# EAGLE design SCA3100-D04 Breakout (EAGLE 8.5.1)
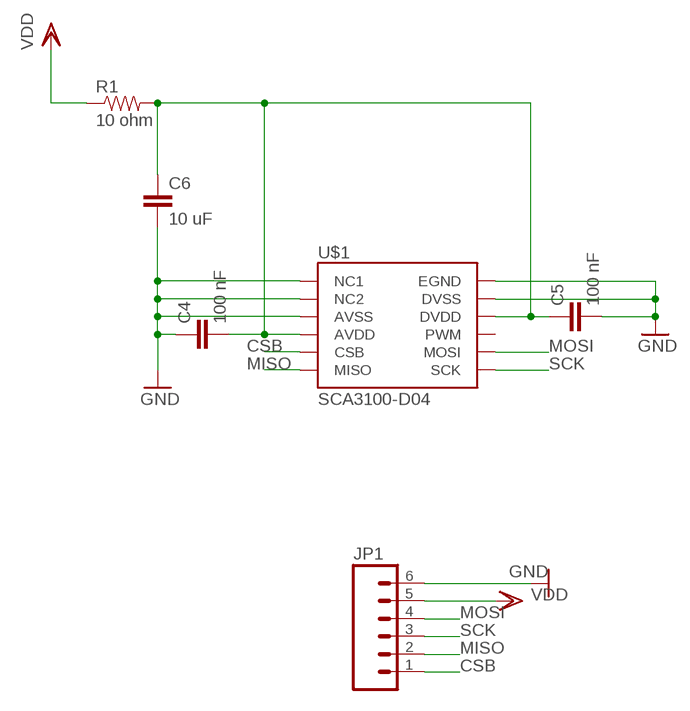
[diagram p0: schematic, sheet 1]

## Parts
C4  100 nF  CAP0805  [0805]
C5  100 nF  CAP0805  [0805]
C6  10 uF  CAP0805  [0805]
JP1  M06  [1X06]
R1  10 ohm  RESISTOR0805-RES  [0805]
U$1  SCA3100-D04  [SCA3100-D04]

## Nets
CSB: JP1.1 U$1.CSB
GND: C4.1 C5.2 C6.2 JP1.6 U$1.AVSS U$1.DVSS U$1.EGND U$1.NC1 U$1.NC2
MISO: JP1.2 U$1.MISO
MOSI: JP1.4 U$1.MOSI
N$4: C4.2 C5.1 C6.1 R1.2 U$1.AVDD U$1.DVDD
SCK: JP1.3 U$1.SCK
VDD: JP1.5 R1.1
Unconnected: U$1.PWM

## Library data of the parts
C4-C6 = HyTechDevices:CAP: Capacitor Standard 0603 ceramic capacitor, and 0.1" leaded capacitor.
JP1 = HyTechDevices:M06: Standard 6-pin 0.1" header. NOTES ON THE VARIANTS LOCK and LOCK_LONGPADS... This footprint was designed to help hold the alignment of a through-hole component (i.e. 6-pin header) while soldering it into place. You may notice that each hole has been shifted either up or down by 0.005 of an inch from it's more standard position (which is a perfectly straight line). This slight alteration caused the pins (the squares in the middle) to touch the edges of the holes. Because they are alternating, it causes a "brace" to hold the component in place. 0.005 has proven to be the perfect amount of "off-center" position when using our standard breakaway headers. Although looks a little odd when you look at the bare footprint, once you have a header in there, the alteration is very hard to notice. Also,if you push a header all the way into place, it is covered up entirely on the bottom side. This idea of altering the position of holes to aid alignment will be further integrated into the Sparkfun Library for other footprints. It can help hold any component with 3 or more connection pins. Note: The Sparkfun version includes many other packages including surface mount that may be of future interest. Source: Sparkfun <https://github.com/sparkfun/SparkFun-Eagle-Libraries>
R1 = HyTechDevices:RESISTOR: Resistor Basic schematic elements and footprints for 0603, 1206, and PTH resistors.
U$1 = HyTechDevices:SCA3100-D04: Murata SCA3100-D04 3-axis accelerometer Datasheet <http://www.mouser.com/pdfdocs/SCA3300-D01Industrial3-axisaccelerometerDatasheet_A1.pdf>

## Board
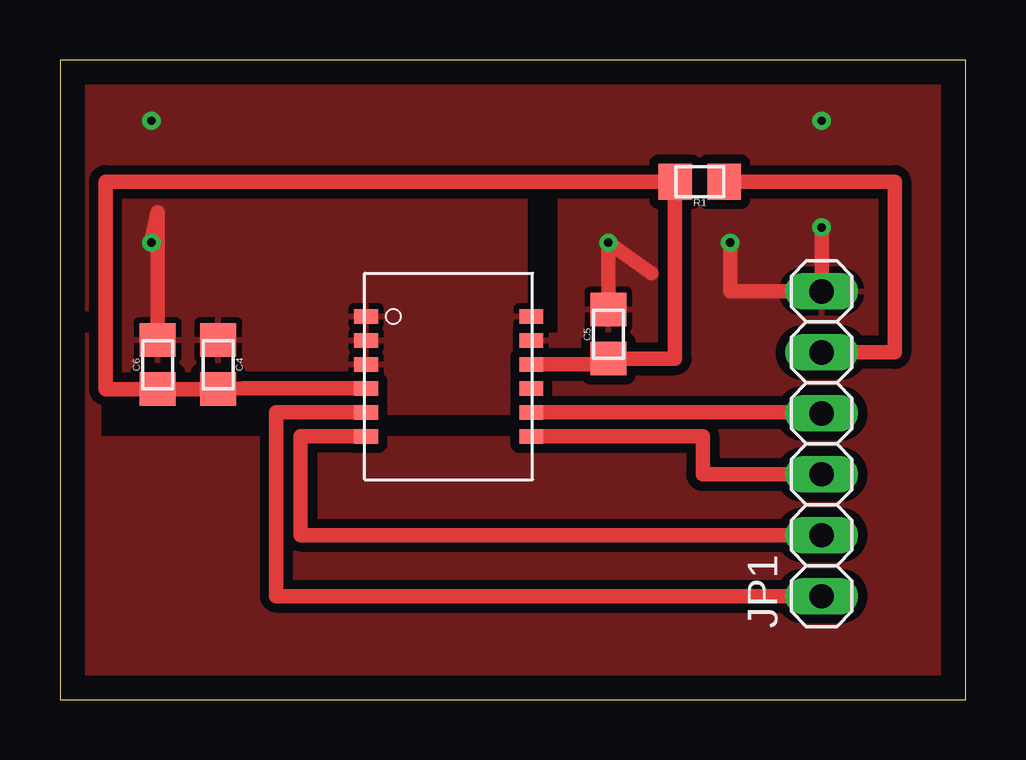
[diagram p1: board, top side]
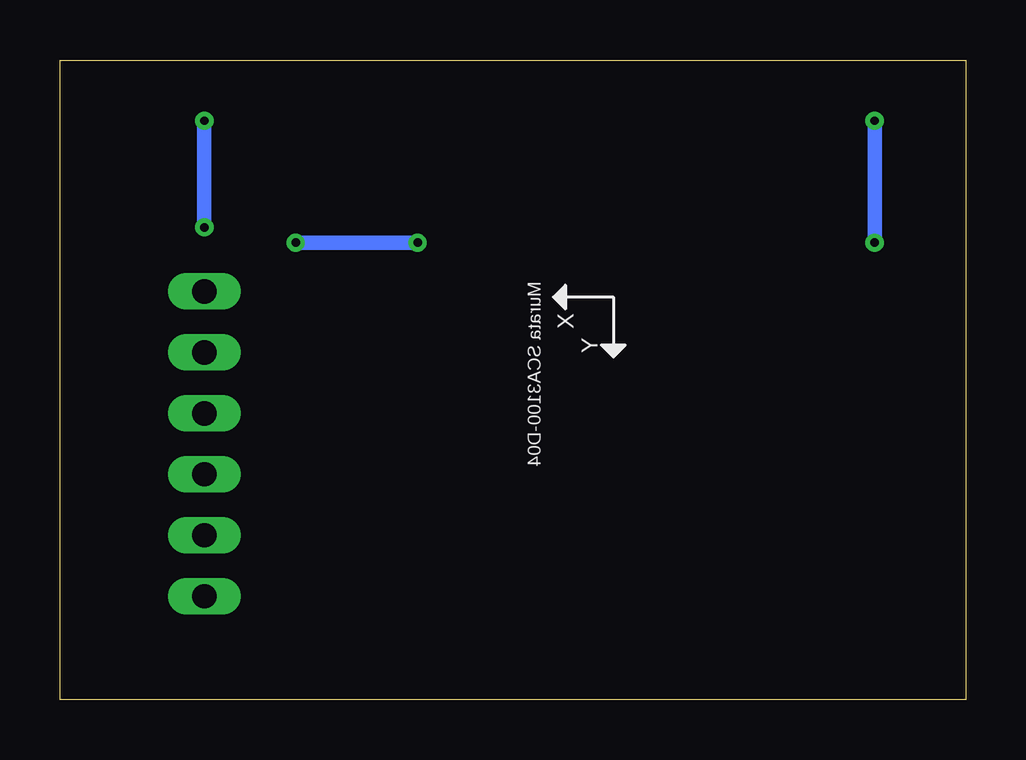
[diagram p2: board, bottom side, seen from below]

Size 37.77 x 26.66 mm. Coordinates in mm from the lower left corner, seen from the top.
Outline: 0,0 37.77,0 37.77,26.66 0,26.66 0,0
Copper layers (1*16): Top 0.035mm / dielectric 1.5mm / Bottom 0.035mm
Design rules "default *": minimum track width 6mil, minimum drill 0.35mm, track to track 15mil, track to pad 15mil, pad to pad 15mil, via to via 15mil, smd to smd 15mil, copper to edge 40mil, drill to drill 6mil, minimum pad ring 10mil, minimum via ring 8mil, stop-mask expansion 4mil, vias tented up to drill 0mil, thermal gap 10mil

### Footprints (pad centres in the part's own frame; a part is rotated, then mirrored left to right if it is on the bottom)
0805 = smd 1.4 x 1.5: 1 -1.025,0; 2 1.025,0
1X06 = drill 1.016 long: 1 -6.35,0; 2 -3.81,0; 3 -1.27,0; 4 1.27,0; 5 3.81,0; 6 6.35,0
SCA3100-D04 = smd 0.98 x 0.61: AVDD 0.06,-4.8; AVSS 0.06,-3.8; CSB 0.06,-5.8; DVDD 6.94,-3.8; DVSS 6.94,-2.8; EGND 6.94,-1.8; MISO 0.06,-6.8; MOSI 6.94,-5.8; NC1 0.06,-1.8; NC2 0.06,-2.8; PWM 6.94,-4.8; SCK 6.94,-6.8

### Placement (x,y rotation side)
C4  6.6,13.97 270 top
C5  22.86,15.24 90 top
C6  4.06,13.97 90 top
JP1  31.75,10.67 90 top
R1  26.67,21.59 180 top
U$1  12.7,17.78 0 top

### Tracks (layer width: path | path; a pad name or v marks a point on that pad's centre or on a via)
CSB
  Top 0.61: U$1.CSB 9.02,11.98 9.02,4.32 JP1.1
GND  (via drill 0.35)
  Top 0.61: C5.2 v22.86,19.05 24.65,17.78 | v27.94,19.05 27.94,17.02 JP1.6 v31.75,19.69 | C6.2 4.06,20.32 v3.81,19.05
  Bottom 0.61: v22.86,19.05 v27.94,19.05 | v3.81,19.05 v3.81,24.13 | v31.75,19.69 v31.75,24.13
  pour Top: 1.65,10.92 19.94,10.92 19.94,15.24 20.83,15.24 20.83,21.97 1.65,21.97 1.65,16.26 -1.27,16.26 -1.27,27.94 38.1,27.94 38.1,-1.27 -1.27,-1.27 -1.27,15.24 1.65,15.24
  pour Top: 2.29,12.95 2.29,21.34 19.43,21.34 19.43,15.62 18.8,15.62 18.8,11.94 12.7,11.94 12.7,12.95
MISO
  Top 0.61: U$1.MISO 10.03,10.98 10.03,6.86 JP1.2
MOSI
  Top 0.61: U$1.MOSI 31.75,11.98 JP1.4
N$4
  Top 0.61: U$1.AVDD 7.66,12.98 C4.2 C6.1 1.91,12.94 1.91,21.59 R1.2 25.64,14.21 C5.1 22.86,13.98 U$1.DVDD
SCK
  Top 0.61: U$1.SCK 26.8,10.98 26.8,9.4 JP1.3
VDD
  Top 0.61: R1.1 34.8,21.59 34.8,14.48 JP1.5